# EAGLE design smartFootballTable_ver1 (EAGLE 8.1.1)
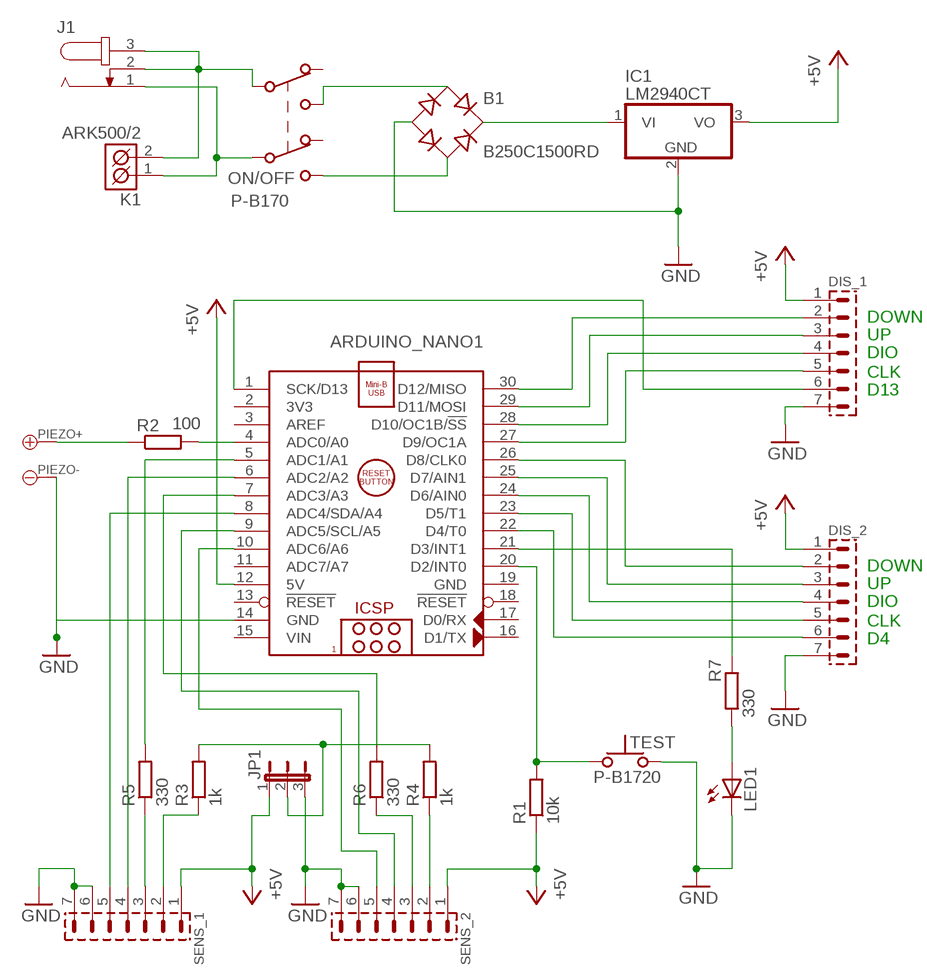
[diagram p0: schematic, sheet 1]

## Parts
ARDUINO_NANO1  ARDUINO_NANO  [ARDUINO_NANO]
B1  B250C1500RD  RECTIFIER-RB1A  [RB1A]
DIS_1  PSH02-07W  [PSH02-07W]
DIS_2  PSH02-07W  [PSH02-07W]
IC1  LM2940CT  LM340H-05  [TO220H]
J1  JACK-PLUG1  [SPC4078]
JP1  JP2W  [JP2W]
K1  ARK500/2  [ARK500/2]
LED1  LED5MM  [LED5MM]
ON/OFF  P-B170  [P-B170]
PIEZO+  PAD_1+  [PAD_1]
PIEZO-  PAD_1-  [PAD_1]
R1  10k  R-EU_0204/7  [0204/7]
R2  100  R-EU_0204/7  [0204/7]
R3  1k  R-EU_0204/7  [0204/7]
R4  1k  R-EU_0204/7  [0204/7]
R5  330  R-EU_0204/7  [0204/7]
R6  330  R-EU_0204/7  [0204/7]
R7  330  R-EU_0204/7  [0204/7]
SENS_1  PSH02-07W  [PSH02-07W]
SENS_2  PSH02-07W  [PSH02-07W]
TEST  P-B1720  [P-B1720]

## Nets
+5V: ARDUINO_NANO1.12(5V) DIS_1.1 DIS_2.1 IC1.3(VO) JP1.1 R1.1 SENS_1.1 SENS_2.1
A0: ARDUINO_NANO1.4(ADC0/A0) R2.2
A1: ARDUINO_NANO1.5(ADC1/A1) R5.2
A2: ARDUINO_NANO1.6(ADC2/A2) SENS_1.4
A3: ARDUINO_NANO1.7(ADC3/A3) R6.2
A4: ARDUINO_NANO1.9(ADC5/SCL/A5) SENS_2.4
A5: ARDUINO_NANO1.8(ADC4/SDA/A4) SENS_1.5
A6: ARDUINO_NANO1.10(ADC6/A6) SENS_2.5
D2: ARDUINO_NANO1.20(D2/INT0) R1.2 TEST.1
D3: ARDUINO_NANO1.21(D3/INT1) R7.2
D4: ARDUINO_NANO1.22(D4/T0) DIS_2.6
D11: ARDUINO_NANO1.29(D11/MOSI) DIS_1.3
D12: ARDUINO_NANO1.30(D12/MISO) DIS_1.2
D13: ARDUINO_NANO1.1(SCK/D13) DIS_1.6
DIS1_CLK: ARDUINO_NANO1.27(D9/OC1A) DIS_1.5
DIS1_DIO: ARDUINO_NANO1.28(D10/OC1B/!SS) DIS_1.4
DIS2_CLK: ARDUINO_NANO1.23(D5/T1) DIS_2.5
DIS2_DIO: ARDUINO_NANO1.24(D6/AIN0) DIS_2.4
DIS2_DOWN: ARDUINO_NANO1.26(D8/CLK0) DIS_2.2
DIS2_UP: ARDUINO_NANO1.25(D7/AIN1) DIS_2.3
GND: ARDUINO_NANO1.14(GND) B1.- DIS_1.7 DIS_2.7 IC1.2(GND) JP1.3 LED1.K(C) PIEZO-.1(-) SENS_1.6 SENS_1.7 SENS_2.6 SENS_2.7 TEST.2
N$1: J1.1 K1.1(K1) ON/OFF.6(X2)
N$3: B1.AC2 ON/OFF.5(R2)
N$4: B1.AC1 ON/OFF.2(R1)
N$5: J1.2 J1.3 K1.2(K2) ON/OFF.3(X1)
N$8: PIEZO+.1(+) R2.1
N$20: R3.1 SENS_1.2
N$21: R4.1 SENS_2.2
N$22: R5.1 SENS_1.3
N$23: R6.1 SENS_2.3
N$25: LED1.A R7.1
N$31: JP1.2 R3.2 R4.2
VCC: B1.+ IC1.1(VI)
Unconnected: ARDUINO_NANO1.2(3V3) ARDUINO_NANO1.3(AREF) ARDUINO_NANO1.11(ADC7/A7) ARDUINO_NANO1.13(!RESET) ARDUINO_NANO1.16(D1/TX) ARDUINO_NANO1.17(D0/RX) ARDUINO_NANO1.18(!RESET) ON/OFF.1(S1) ON/OFF.4(S2) TEST.3(1A) TEST.4(2A)

## Notes on the sheet
- DOWN
- UP
- DIO
- CLK
- D13
- DOWN
- UP
- DIO
- CLK
- D4

## Power pins joined to a net without a drawn wire
GND: ARDUINO_NANO1.19(GND)
VIN: ARDUINO_NANO1.15(VIN)

## Library data of the parts
ARDUINO_NANO1 = ArduinoNanoV30:ARDUINO_NANO: Arduino Nano V3.0 Module Overview: The Arduino Nano is a small, complete, and breadboard-friendly board based on the ATmega328 (Arduino Nano 3.x) or ATmega168 (Arduino Nano 2.x). It has more or less the same functionality of the Arduino Duemilanove, but in a different package. It lacks only a DC power jack, and works with a Mini-B USB cable instead of a standard one. The Nano was designed and is being produced by Gravitech <http://www.gravitech.us/arna30wiatp.html>. General specifications: Item Value Microcontroller Atmel ATmega168 or ATmega328 Operating Voltage (logic level) 5 V Input Voltage (recommended) 7-12 V Input Voltage (limits) 6-20 V Digital I/O Pins 14 (of which 6 provide PWM output) Analog Input Pins 8 DC Current per I/O Pin 40 mA Flash Memory 16 KB (ATmega168) or 32 KB (ATmega328) of which 2 KB used by bootloader SRAM 1 KB (ATmega168) or 2 KB (ATmega328) EEPROM 512 bytes (ATmega168) or 1 KB (ATmega328) Clock Speed 16 MHz Dimensions (Inches) 0.73" x 1.70" Dimensions (mm) 18mm x 45mm Overall height About 9 mm (not including pins) Weigth 5 g Power: The Arduino Nano can be powered via the Mini-B USB connection, 6-20V unregulated external power supply (pin 30), or 5V regulated external power supply (pin 27). The power source is automatically selected to the highest voltage source. Memory: The ATmega168 has 16 KB of flash memory for storing code (of which 2 KB is used for the bootloader); the ATmega328 has 32 KB, (also with 2 KB used for the bootloader). The ATmega168 has 1 KB of SRAM and 512 bytes of EEPROM (which can be read and written with the EEPROM library); the ATmega328 has 2 KB of SRAM and 1 KB of EEPROM. Input and Output: Each of the 14 digital pins on the Nano can be used as an input or output, using pinMode(), digitalWrite(), and digitalRead() functions. They operate at 5 volts. Each pin can provide or receive a maximum of 40 mA and has an internal pull-up resistor (disconnected by default) of 20-50 kOhms. In addition, some pins have specialized functions. Visit Arduino - ArduinoBoardNano <https://www.arduino.cc/en/Main/ArduinoBoardNano>
B1 = rectifier:RECTIFIER-: Rectifier; OC_NEWARK: unknown
DIS_1 DIS_2 SENS_1 SENS_2 = #PaJa_konektory:PSH02-07: Konektory se zamkem - vidlice - 7pin
IC1 = linear:LM340?-*: Positive VOLTAGE REGULATOR Source: http://cache.national.com/ds/LM/LM340.pdf; MF: NATIONAL SEMICONDUCTOR; MPN: LM2940CT-5.0/NOPB; OC_NEWARK: 41K4577
J1 = con-jack:JACK-PLUG: DC POWER JACK Power Jack, DC, Right Angle, Through Hole, Rated 5A at 16VDC, PC Terminals Distributor: Farnell (www.Farnell.de) Drawing: 84N1161.pdf / 84N1162.pdf Manufacturer: SPC Technology (www.spctechnology.com) Type: SPC4077 / SPC 4078; OC_FARNELL: unknown; OC_NEWARK: unknown
JP1 = jumper:JP2W: JUMPER
K1 = #PaJa_konektory:ARK500/2: Svorkovnice - roztec 5mm - dvojita
LED1 = led:LED: LED OSRAM: - CHIPLED LG R971, LG N971, LY N971, LG Q971, LY Q971, LO R971, LY R971 LH N974, LH R974 LS Q976, LO Q976, LY Q976 LO Q996 - Hyper CHIPLED LW Q18S LB Q993, LB Q99A, LB R99A - SideLED LS A670, LO A670, LY A670, LG A670, LP A670 LB A673, LV A673, LT A673, LW A673 LH A674 LY A675 LS A676, LA A676, LO A676, LY A676, LW A676 LS A679, LY A679, LG A679 - Hyper Micro SIDELED® LS Y876, LA Y876, LO Y876, LY Y876 LT Y87S - SmartLED LW L88C, LW L88S LB L89C, LB L89S, LG L890 LS L89K, LO L89K, LY L89K LS L896, LA L896, LO L896, LY L896 - TOPLED LS T670, LO T670, LY T670, LG T670, LP T670 LSG T670, LSP T670, LSY T670, LOP T670, LYG T670 LG T671, LOG T671, LSG T671 LB T673, LV T673, LT T673, LW T673 LH T674 LS T676, LA T676, LO T676, LY T676, LB T676, LH T676, LSB T676, LW T676 LB T67C, LV T67C, LT T67C, LS T67K, LO T67K, LY T67K, LW E67C LS E67B, LA E67B, LO E67B, LY E67B, LB E67C, LV E67C, LT E67C LW T67C LS T679, LY T679, LG T679 LS T770, LO T770, LY T770, LG T770, LP T770 LB T773, LV T773, LT T773, LW T773 LH T774 LS E675, LA E675, LY E675, LS T675 LS T776, LA T776, LO T776, LY T776, LB T776 LHGB T686 LT T68C, LB T68C - Hyper Mini TOPLED® LB M676 - Mini TOPLED Santana® LG M470 LS M47K, LO M47K, LY M47K Source: http://www.osram.convergy.de LUXEON: - LUMILED® LXK2-PW12-R00, LXK2-PW12-S00, LXK2-PW14-U00, LXK2-PW14-V00 LXK2-PM12-R00, LXK2-PM12-S00, LXK2-PM14-U00 LXK2-PE12-Q00, LXK2-PE12-R00, LXK2-PE12-S00, LXK2-PE14-T00, LXK2-PE14-U00 LXK2-PB12-K00, LXK2-PB12-L00, LXK2-PB12-M00, LXK2-PB14-N00, LXK2-PB14-P00, LXK2-PB14-Q00 LXK2-PR12-L00, LXK2-PR12-M00, LXK2-PR14-Q00, LXK2-PR14-R00 LXK2-PD12-Q00, LXK2-PD12-R00, LXK2-PD12-S00 LXK2-PH12-R00, LXK2-PH12-S00 LXK2-PL12-P00, LXK2-PL12-Q00, LXK2-PL12-R00 Source: www.luxeon.com KINGBRIGHT: KA-3528ASYC Source: www.kingbright.com; OC_NEWARK: unknown
ON/OFF = #PaJa_prepinace:P-B170: Tlacitkovy prepinac - dvojity (8 x 8mm) P-B170G - s aretaci P-B170H - bez aretace
PIEZO+ = #PaJa_31:PAD_1+: Pajeci bod - 2,54 mm prumer, + kladny
PIEZO- = #PaJa_31:PAD_1-: Pajeci bod - 2,54 mm prumer, - zaporny
R1-R7 = resistor:R-EU_: RESISTOR, European symbol; OC_NEWARK: unknown
TEST = #PaJa_prepinace:P-B1720: µ-tlacitko

## Board
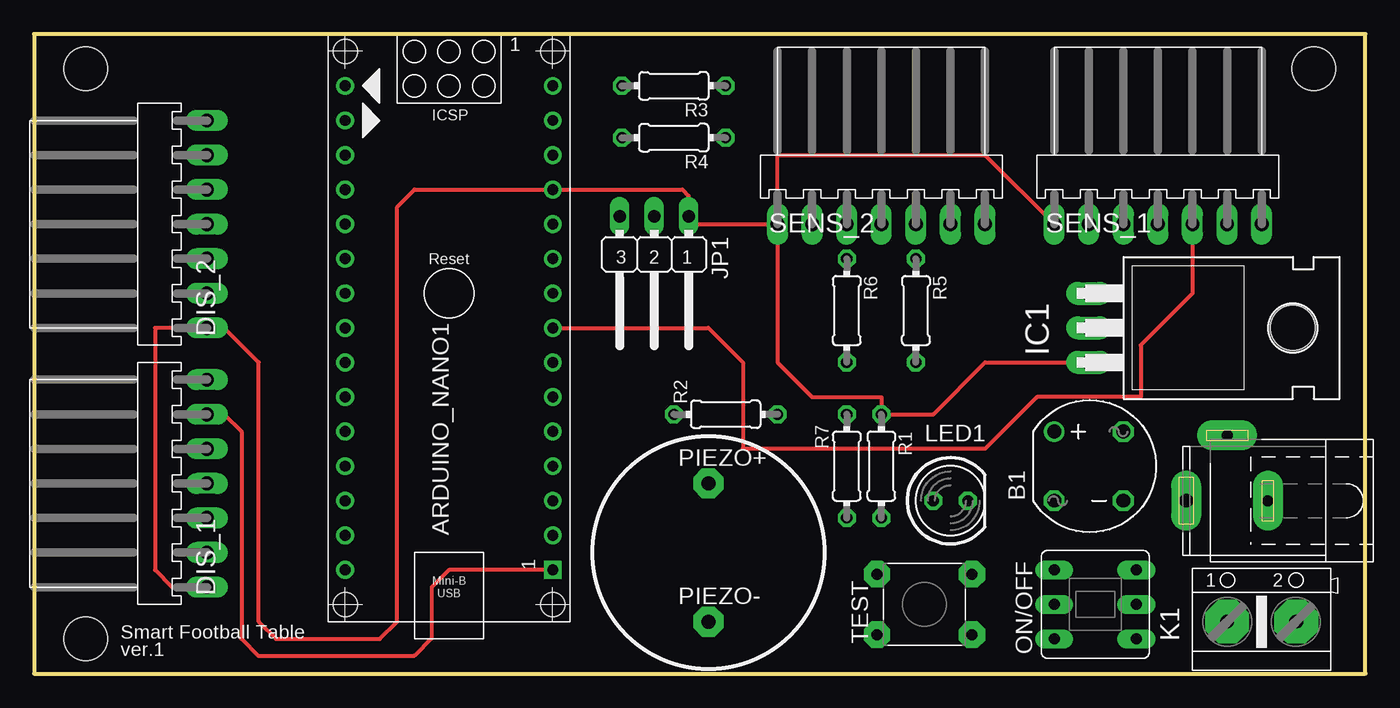
[diagram p1: board, top side]
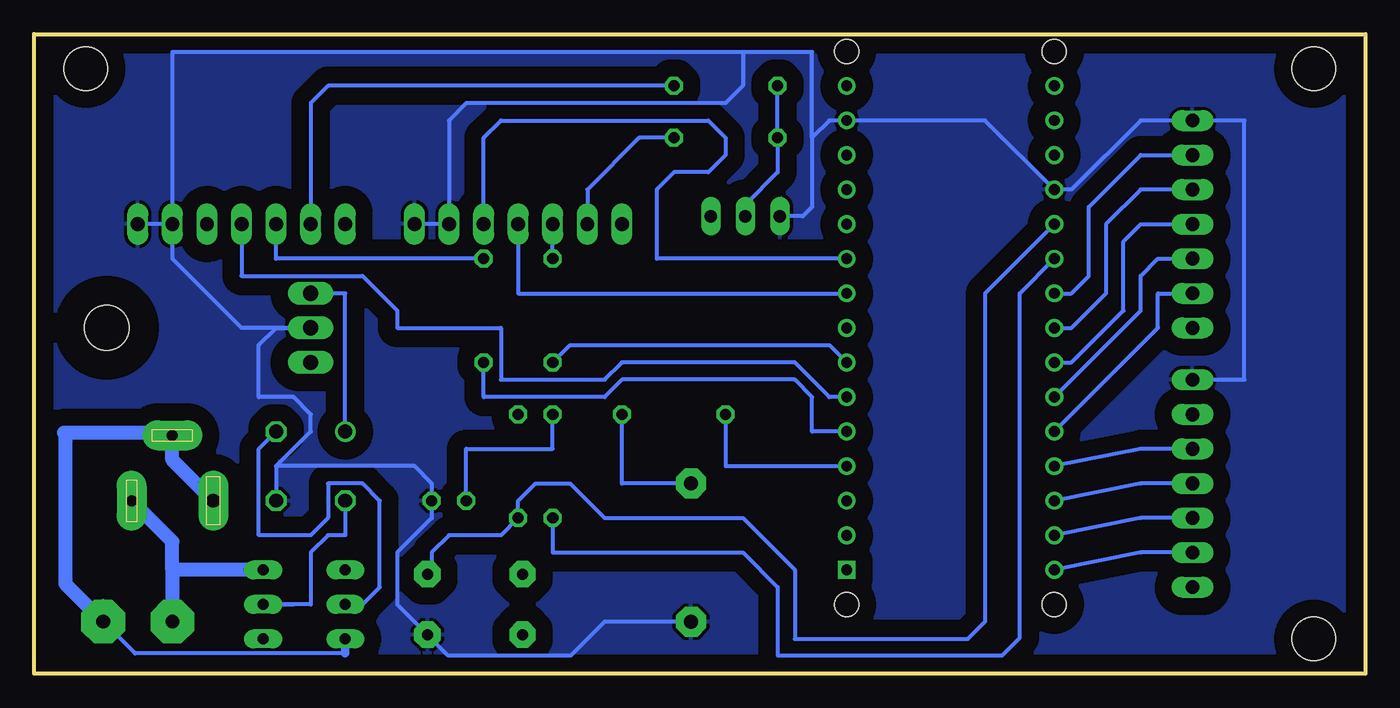
[diagram p2: board, bottom side, seen from below]

Size 97.79 x 46.99 mm. Coordinates in mm from the lower left corner, seen from the top.
Outline: 0,0 97.79,0 97.79,46.99 0,46.99 0,0
Copper layers (1*16): Top 0.035mm / dielectric 1.5mm / Bottom 0.035mm
Design rules "default": minimum track width 10mil, minimum drill 24mil, track to track 8mil, track to pad 8mil, pad to pad 8mil, via to via 8mil, smd to smd 8mil, copper to edge 40mil, drill to drill 8mil, minimum pad ring 10mil, minimum via ring 8mil, stop-mask expansion 4mil, vias tented up to drill 0mil, thermal gap 10mil
Holes 3.2 mm at 3.81,44.45 3.81,2.54 93.98,44.45

### Footprints (pad centres in the part's own frame; a part is rotated, then mirrored left to right if it is on the bottom)
ARDUINO_NANO = drill 0.8 square: 1 -20.32,-7.62 | drill 0.8: 2 -17.78,-7.62; 3 -15.24,-7.62; 4 -12.7,-7.62; 5 -10.16,-7.62; 6 -7.62,-7.62; 7 -5.08,-7.62; 8 -2.54,-7.62; 9 0,-7.62; 10 2.54,-7.62; 11 5.08,-7.62; 12 7.62,-7.62; 13 10.16,-7.62; 14 12.7,-7.62; 15 15.24,-7.62; 16 15.24,7.62; 17 12.7,7.62; 18 10.16,7.62; 19 7.62,7.62; 20 5.08,7.62; 21 2.54,7.62; 22 0,7.62; 23 -2.54,7.62; 24 -5.08,7.62; 25 -7.62,7.62; 26 -10.16,7.62; 27 -12.7,7.62; 28 -15.24,7.62; 29 -17.78,7.62; 30 -20.32,7.62 | hole 1.778: -22.86,-7.62; -22.86,7.62; 17.78,7.62; 17.78,-7.62
RB1A = drill 1.016: + -2.54,2.54 | drill 1.016 octagon: - 2.54,-2.54; AC1 2.54,2.54; AC2 -2.54,-2.54
PSH02-07W = drill 1.016 pad 1.422 long: 1 -7.62,0; 2 -5.08,0; 3 -2.54,0; 4 0,0; 5 2.54,0; 6 5.08,0; 7 7.62,0
TO220H = drill 1.118 long: 1 -2.54,-10.16; 2 0,-10.16; 3 2.54,-10.16 | hole 3.302: 0,4.826
SPC4078 = drill 0.8 pad 2.184 long: 1 -3,0; 2 0,-4.8 | drill 1 pad 2.184 long: 3 3,0
JP2W = drill 0.914 long: 1 -2.54,-1.27; 2 0,-1.27; 3 2.54,-1.27
ARK500/2 = drill 1 pad 3.2 octagon: 1 -2.54,0; 2 2.54,0
LED5MM = drill 0.813 octagon: A -1.27,0; K 1.27,0
P-B170 = drill 0.813 pad 1.4 long: 1 0,5.08; 2 0,2.54; 3 0,0; 4 6.032,0; 5 6.032,2.54; 6 6.032,5.08
PAD_1 = drill 1.016 pad 2.184 octagon: 1 0,0
0204/7 = drill 0.813 octagon: 1 -3.81,0; 2 3.81,0
P-B1720 = drill 0.813 pad 1.93 octagon: 1 -3.493,-2.223; 2 -3.493,2.223; 3 3.493,-2.223; 4 3.493,2.223

### Placement (x,y rotation side)
ARDUINO_NANO1  30.48,27.94 90 top
B1  77.47,15.24 0 top
DIS_1  12.7,13.97 90 top
DIS_2  12.7,33.02 90 top
IC1  87.63,25.4 270 top
J1  87.63,12.7 180 top
JP1  45.55,32.34 180 top
K1  90.17,3.81 0 top
LED1  67.31,12.7 0 top
ON/OFF  74.93,2.54 0 top
PIEZO+  49.53,13.97 0 top
PIEZO-  49.53,3.81 0 top
R1  62.23,15.24 270 top
R2  50.8,19.05 180 top
R3  46.99,43.18 180 top
R4  46.99,39.37 180 top
R5  64.77,26.67 270 top
R6  59.69,26.67 270 top
R7  59.69,15.24 270 top
SENS_1  82.55,33.02 0 top
SENS_2  62.23,33.02 0 top
TEST  65.41,5.08 180 top

### Tracks (layer width: path | path; a pad name or v marks a point on that pad's centre or on a via)
+5V
  Top 0.305: DIS_1.1 10.16,6.35 8.89,7.62 8.89,25.4 DIS_2.1 13.97,25.4 16.51,22.86 16.51,3.81 17.78,2.54 25.4,2.54 26.67,3.81 26.67,34.29 27.94,35.56 ARDUINO_NANO1.12 47.62,35.56 48.09,35.1 JP1.1 48.68,33.02 SENS_2.1 | SENS_2.1 54.61,22.86 57.15,20.32 62.23,20.32 R1.1 66.04,19.05 69.85,22.86 IC1.3 | SENS_2.1 54.61,38.1 69.85,38.1 SENS_1.1
A0
  Bottom 0.305: R2.2 46.99,15.24 ARDUINO_NANO1.4
A1
  Bottom 0.305: R5.2 64.77,20.32 55.88,20.32 54.61,21.59 41.91,21.59 40.64,20.32 40.64,17.78 ARDUINO_NANO1.5
A2
  Bottom 0.305: SENS_1.4 82.55,29.21 73.66,29.21 71.12,26.67 71.12,25.4 63.5,25.4 63.5,21.59 55.88,21.59 54.61,22.86 41.91,22.86 39.37,20.32 ARDUINO_NANO1.6
A3
  Bottom 0.305: R6.2 58.42,24.13 39.37,24.13 ARDUINO_NANO1.7
A4
  Bottom 0.305: SENS_2.4 62.23,27.94 ARDUINO_NANO1.9
A5
  Top 0.305: ARDUINO_NANO1.8 49.53,25.4 52.07,22.86 52.07,16.51 69.85,16.51 73.66,20.32 81.28,20.32 81.28,24.13 85.09,27.94 SENS_1.5
A6
  Bottom 0.305: ARDUINO_NANO1.10 52.07,30.48 52.07,35.56 50.8,36.83 48.26,36.83 46.99,38.1 46.99,39.37 48.26,40.64 63.5,40.64 64.77,39.37 SENS_2.5
D2
  Bottom 0.305: TEST.1 68.58,7.62 68.58,8.89 67.31,10.16 63.5,10.16 R1.2 62.23,12.7 60.96,13.97 58.42,13.97 55.88,11.43 45.72,11.43 41.91,7.62 41.91,2.54 29.21,2.54 27.94,3.81 27.94,27.94 ARDUINO_NANO1.20
D3
  Bottom 0.305: R7.2 59.69,8.89 45.72,8.89 43.18,6.35 43.18,1.32 26.72,1.32 25.4,2.64 25.4,27.94 ARDUINO_NANO1.21
D4
  Bottom 0.305: 13.97,38.1 DIS_2.6 16.51,38.1 20.32,34.29 20.32,29.21 21.59,27.94 ARDUINO_NANO1.22
D11
  Bottom 0.305: DIS_1.3 16.51,11.43 ARDUINO_NANO1.29
D12
  Bottom 0.305: DIS_1.2 16.51,8.89 ARDUINO_NANO1.30
D13
  Top 0.305: DIS_1.6 13.97,19.05 15.24,17.78 15.24,2.54 16.46,1.32 27.94,1.32 29.21,2.59 29.21,6.35 30.48,7.62 ARDUINO_NANO1.1
DIS1_CLK
  Bottom 0.305: DIS_1.5 16.51,16.51 ARDUINO_NANO1.27
DIS1_DIO
  Bottom 0.305: DIS_1.4 16.51,13.97 ARDUINO_NANO1.28
DIS2_CLK
  Bottom 0.305: 13.97,35.56 DIS_2.5 16.51,35.56 19.05,33.02 19.05,27.94 21.59,25.4 ARDUINO_NANO1.23
DIS2_DIO
  Bottom 0.305: ARDUINO_NANO1.24 21.59,22.86 17.78,26.67 17.78,31.75 16.51,33.02 DIS_2.4
DIS2_DOWN
  Bottom 0.305: ARDUINO_NANO1.26 15.24,25.4 15.24,27.94 DIS_2.2
DIS2_UP
  Bottom 0.305: 13.97,30.48 DIS_2.3 15.24,30.48 16.51,29.21 16.51,26.67 ARDUINO_NANO1.25
GND
  Bottom 0.305: 80.01,15.24 B1.- | 80.01,15.24 77.47,17.78 77.47,19.05 78.74,20.32 81.28,20.32 81.28,24.13 80.01,25.4 IC1.2 82.55,25.4 87.63,30.48 SENS_1.6 | SENS_1.6 SENS_1.7 | 80.01,15.24 69.85,15.24 68.58,13.97 LED1.K 68.58,11.43 71.12,8.89 71.12,5.08 TEST.2 67.36,1.32 58.37,1.32 55.88,3.81 PIEZO-.1 | DIS_1.7 8.89,21.59 8.89,40.64 DIS_2.7 | DIS_2.7 13.97,40.64 | 40.64,39.37 39.37,40.64 ARDUINO_NANO1.14 27.94,40.64 ARDUINO_NANO1.19 21.59,35.56 16.51,40.64 DIS_2.7 | 40.64,39.37 40.64,34.29 41.32,33.61 JP1.3 | SENS_2.7 SENS_2.6 67.31,40.64 66.04,41.91 46.99,41.91 45.72,43.18 45.72,45.67 | 40.64,39.37 40.64,45.67 45.72,45.67 | 45.72,45.67 87.63,45.67 SENS_1.6
  pour Bottom (isolate 1.27): -1.27,48.26 99.06,48.26 99.06,-1.27 -1.27,-1.27
N$1
  Bottom 1.016: J1.1 87.63,9.7 87.63,7.62 | 87.63,7.62 K1.1 | ON/OFF.6 87.63,7.62
N$3
  Bottom 0.305: 80.01,5.08 ON/OFF.5 | 80.01,5.08 78.74,5.08 | B1.AC2 74.93,10.16 76.2,10.16 77.47,8.89 77.47,5.08 80.01,5.08
N$4
  Bottom 0.305: ON/OFF.2 73.66,5.08 72.39,6.35 72.39,12.7 73.66,13.97 76.2,13.97 76.2,11.43 77.47,10.16 81.28,10.16 81.28,16.51 B1.AC1
N$5
  Bottom 0.305: K1.2 90.37,1.47 74.93,1.47
  Bottom 0.61: 87.91,17.78 J1.2 | ON/OFF.3 74.93,1.47
  Bottom 0.813: K1.2 92.71,5.08
  Bottom 1.016: J1.3 87.63,15.7 J1.2 87.82,17.69 95.58,17.69 95.49,17.61 95.49,6.6 K1.2
N$8
  Bottom 0.305: PIEZO+.1 54.61,13.97 R2.1
N$20
  Bottom 0.305: R3.1 76.2,43.18 77.47,41.91 SENS_1.2
N$21
  Bottom 0.305: R4.1 53.34,39.37 57.15,35.56 SENS_2.2
N$22
  Bottom 0.305: R5.1 80.01,30.48 SENS_1.3
N$23
  Bottom 0.305: R6.1 SENS_2.3
N$25
  Bottom 0.305: LED1.A 66.04,16.51 59.69,16.51 R7.1
N$31
  Bottom 0.305: R3.2 R4.2 43.18,36.83 45.55,34.46 JP1.2
VCC
  Bottom 0.305: B1.+ 74.93,27.94 IC1.1

### Text on the board
tNames: Smart Football Table | ver.1